# EAGLE schematic routev3.3 (EAGLE 8.6.0)

## Sheet 1 of 2
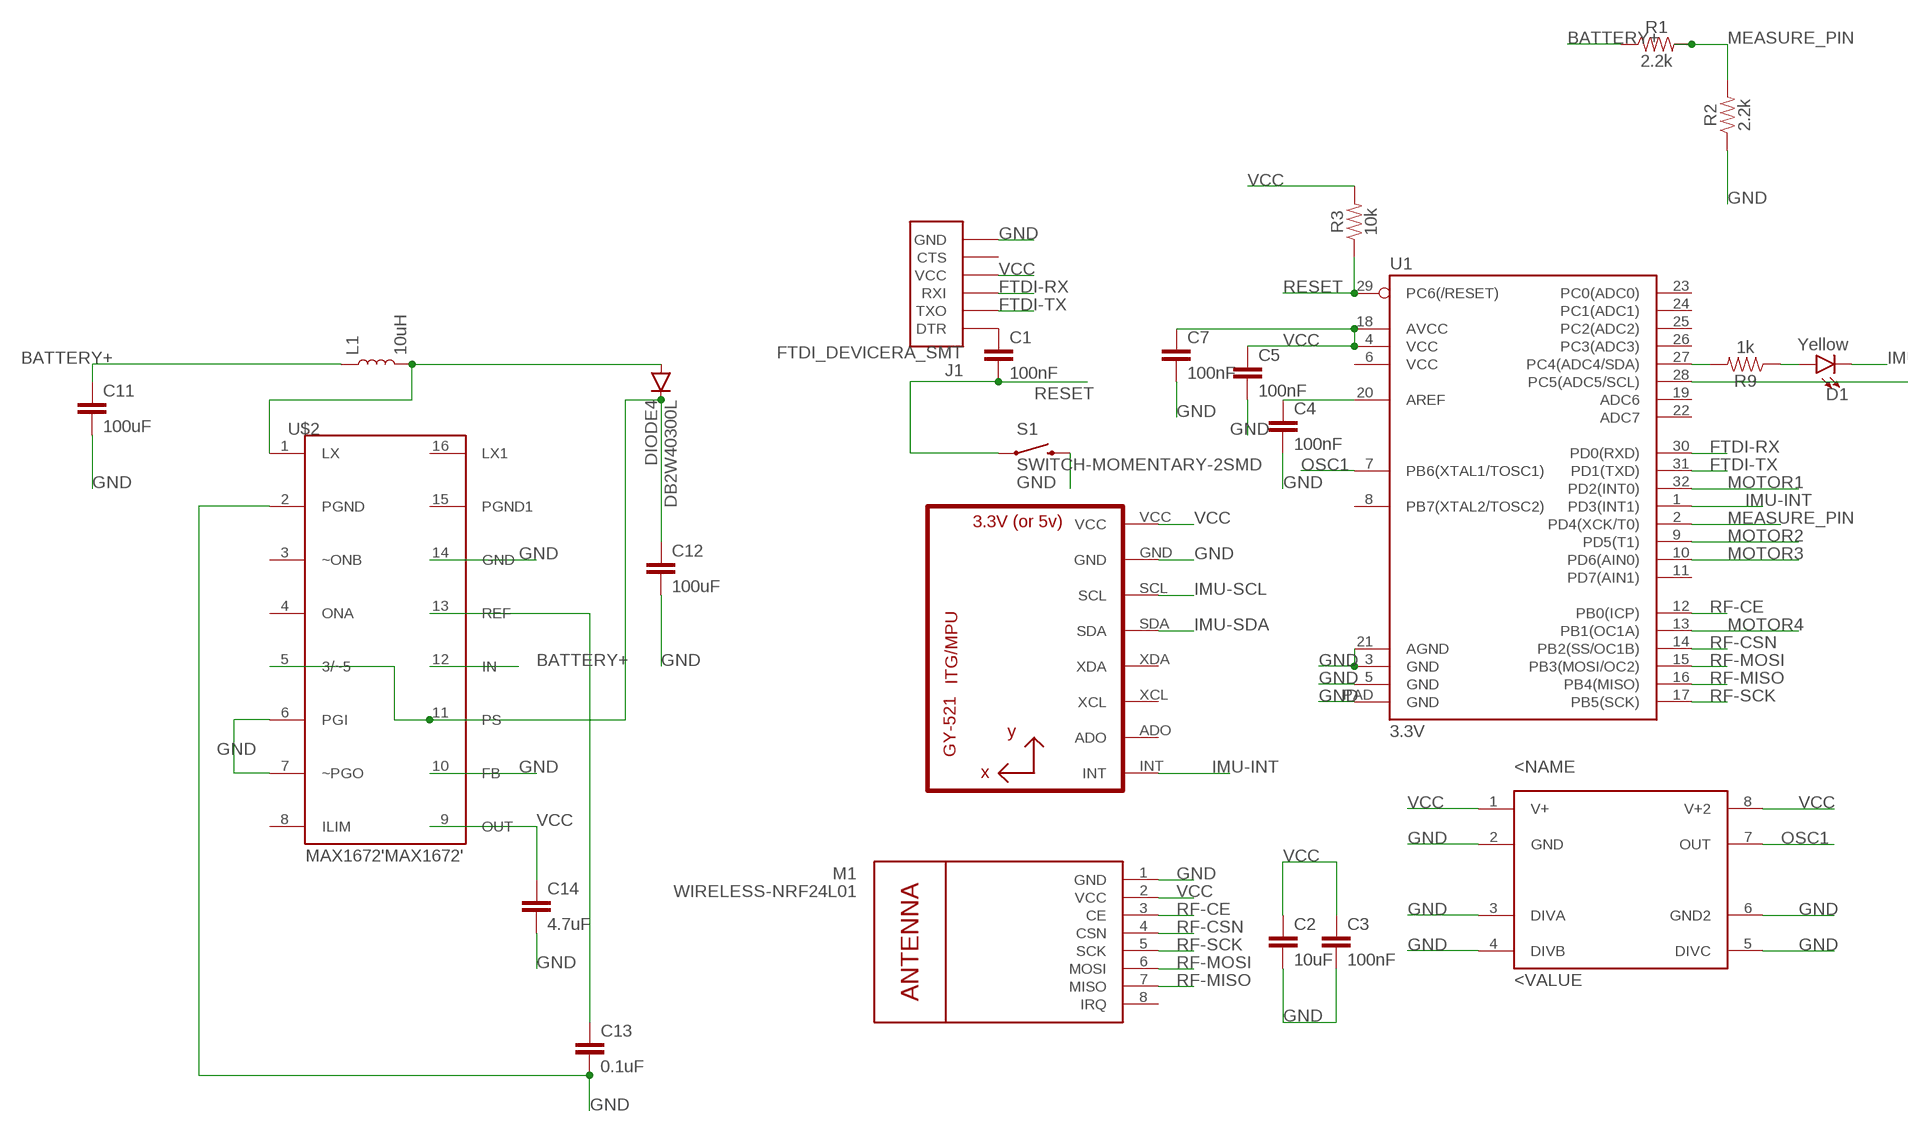
[diagram p0: schematic, sheet 1, part 1 of 2]
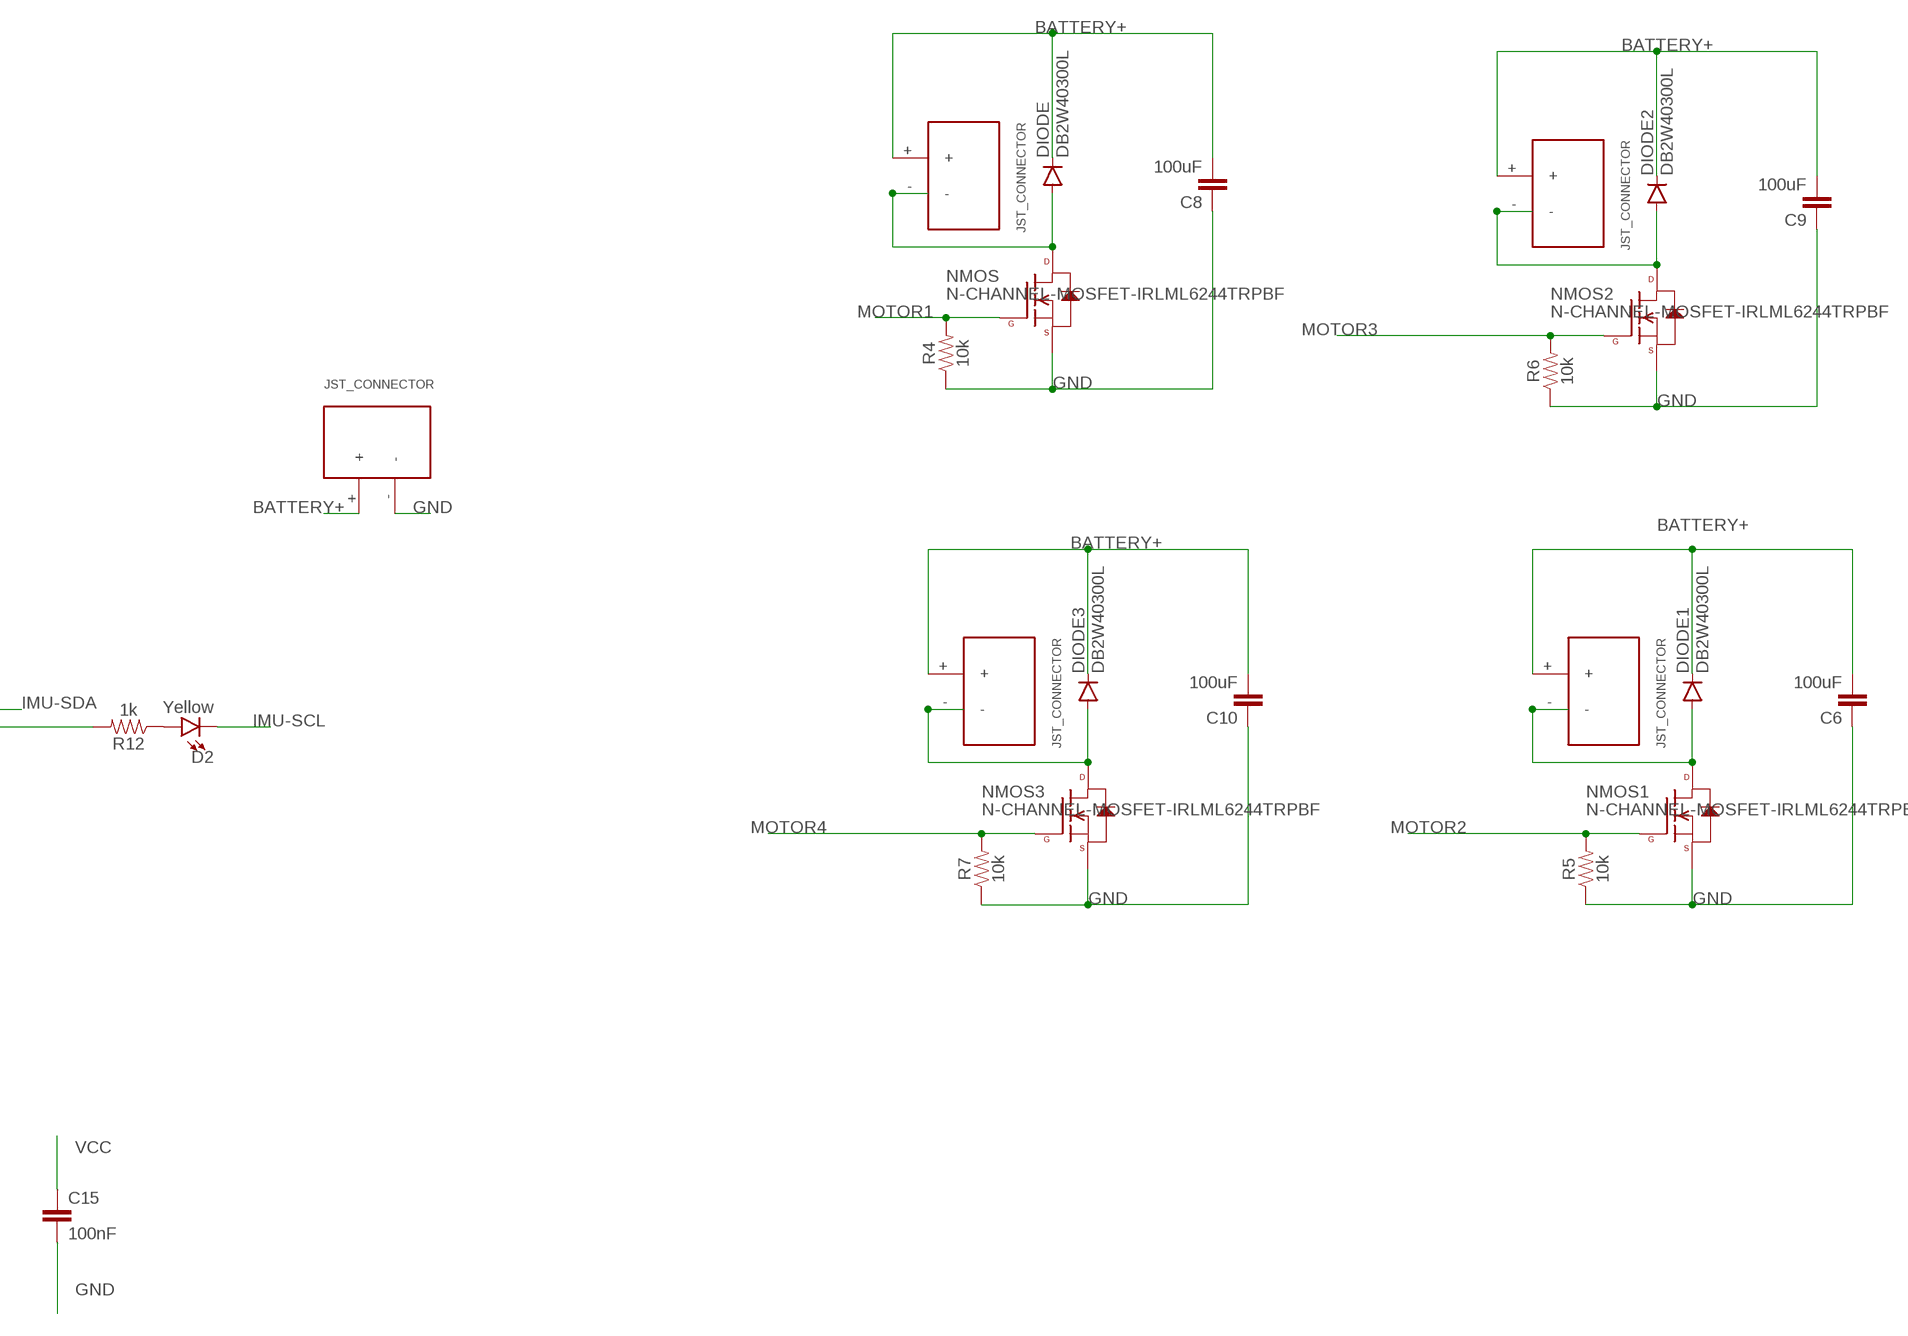
[diagram p1: schematic, sheet 1, part 2 of 2]

### Parts
C1  100nF  0.1UF-25V(+80/-20%)(0603)  [0603-CAP]
C2  10uF  CAP0603-CAP  [0603-CAP]
C3  100nF  CAP0603-CAP  [0603-CAP]
C4  100nF  CAP0603-CAP  [0603-CAP]
C5  100nF  CAP0603-CAP  [0603-CAP]
C6  100uF  CAP0603-CAP  [0603-CAP]
C7  100nF  CAP0603-CAP  [0603-CAP]
C8  100uF  CAP0603-CAP  [0603-CAP]
C9  100uF  CAP0603-CAP  [0603-CAP]
C10  100uF  CAP0603-CAP  [0603-CAP]
C11  100uF  CAP0603-CAP  [0603-CAP]
C12  100uF  CAP0603-CAP  [0603-CAP]
C13  0.1uF  CAP0603-CAP  [0603-CAP]
C14  4.7uF  CAP0603-CAP  [0603-CAP]
C15  100nF  0.1UF-25V(+80/-20%)(0603)  [0603-CAP]
D1  Yellow  LED-YELLOWLILYPAD  [LED-1206]
D2  Yellow  LED-YELLOWLILYPAD  [LED-1206]
DIODE  DB2W40300L  [MINI2-F3-B]
DIODE1  DB2W40300L  [MINI2-F3-B]
DIODE2  DB2W40300L  [MINI2-F3-B]
DIODE3  DB2W40300L  [MINI2-F3-B]
DIODE4  DB2W40300L  [MINI2-F3-B]
J1  FTDI_DEVICERA_SMT  [FTDI_DEVICE_RA_SMT]
L1  10uH  INDUCTOR-0603-33NH  [0603]
M1  WIRELESS-NRF24L01  [WIRELESS-NRF24L01]
MOTOR  JST_CONNECTOR_FEMALE  [JST_CONNECTOR_FEMALE]
MOTOR1  JST_CONNECTOR_FEMALE  [JST_CONNECTOR_FEMALE]
MOTOR2  JST_CONNECTOR_FEMALE  [JST_CONNECTOR_FEMALE]
MOTOR3  JST_CONNECTOR_FEMALE  [JST_CONNECTOR_FEMALE]
NMOS  N-CHANNEL-MOSFET-IRLML6244TRPBF  [SOT23-3]
NMOS1  N-CHANNEL-MOSFET-IRLML6244TRPBF  [SOT23-3]
NMOS2  N-CHANNEL-MOSFET-IRLML6244TRPBF  [SOT23-3]
NMOS3  N-CHANNEL-MOSFET-IRLML6244TRPBF  [SOT23-3]
R1  2.2k  2.2KOHM-0603-1/10W-1%  [0603]
R2  2.2k  2.2KOHM-0603-1/10W-1%  [0603]
R3  10k  2.2KOHM-0603-1/10W-1%  [0603]
R4  10k  2.2KOHM-0603-1/10W-1%  [0603]
R5  10k  2.2KOHM-0603-1/10W-1%  [0603]
R6  10k  2.2KOHM-0603-1/10W-1%  [0603]
R7  10k  2.2KOHM-0603-1/10W-1%  [0603]
R9  1k  2.2KOHM-0603-1/10W-1%  [0603]
R12  1k  2.2KOHM-0603-1/10W-1%  [0603]
S1  SWITCH-MOMENTARY-2SMD  [TACTILE-SWITCH-SMD]
U1  3.3V  ATMEGA328P_MLFMLF32  [MLF32-PAD]
U2  GY-521MPU6050  [GY-521]
U$1  JST_CONNECTOR_FEMALE  [JST_CONNECTOR_FEMALE]
U$2  MAX1672'MAX1672'  [21-0055H_16]
U$3  LTC6930CMS8-8.19LTC6930CMS8-8.19  [SOP65P490X110-8N]

### Nets
BATTERY+ [power]: C6.2 C8.2 C9.2 C10.2 C11.1 DIODE1.NEG(GPIN) DIODE2.NEG(GPIN) DIODE3.NEG(GPIN) DIODE.NEG(GPIN) L1.1 MOTOR1.+ MOTOR2.+ MOTOR3.+ MOTOR.+ R1.1 U$1.+ U$2.12(IN)
FTDI-RX: J1.3(RXI) U1.30(PD0(RXD))
FTDI-TX: J1.2(TXO) U1.31(PD1(TXD))
GND [power]: C2.2 C3.2 C4.2 C5.2 C6.1 C7.2 C8.1 C9.1 C10.1 C11.2 C12.2 C13.2 C14.2 C15.2 J1.6(GND) M1.1(GND) NMOS1.2(S) NMOS2.2(S) NMOS3.2(S) NMOS.2(S) R2.1 R4.1 R5.1 R6.1 R7.1 S1.3 U1.3(GND) U1.5(GND) U1.21(AGND) U1.PAD(GND) U2.GND U$1.- U$2.2(PGND) U$2.6(PGI) U$2.7(~PGO) U$2.10(FB) U$2.14(GND) U$3.2(GND) U$3.3(DIVA) U$3.4(DIVB) U$3.5(DIVC) U$3.6(GND2)
IMU-INT: U1.1(PD3(INT1)) U2.INT
IMU-SCL: D2.C U2.SCL
IMU-SDA: D1.C U2.SDA
MEASURE_PIN: R1.2 R2.2 U1.2(PD4(XCK/T0))
MOTOR1 [analog]: NMOS.1(G) R4.2 U1.32(PD2(INT0))
MOTOR2 [analog]: NMOS1.1(G) R5.2 U1.9(PD5(T1))
MOTOR3 [analog]: NMOS2.1(G) R6.2 U1.10(PD6(AIN0))
MOTOR4 [analog]: NMOS3.1(G) R7.2 U1.13(PB1(OC1A))
N$1: DIODE4.POS(PPIN) L1.2 U$2.1(LX)
N$2: C4.1 U1.20(AREF)
N$3: R9.2 U1.27(PC4(ADC4/SDA))
N$4: DIODE1.POS(PPIN) MOTOR1.- NMOS1.3(D)
N$5: DIODE2.POS(PPIN) MOTOR2.- NMOS2.3(D)
N$6: DIODE.POS(PPIN) MOTOR.- NMOS.3(D)
N$7: DIODE3.POS(PPIN) MOTOR3.- NMOS3.3(D)
N$8: D1.A R9.1
N$9: D2.A R12.1
N$10: R12.2 U1.28(PC5(ADC5/SCL))
N$13: C1.1 J1.1(DTR)
OSC1: U1.7(PB6(XTAL1/TOSC1)) U$3.7(OUT)
RESET: C1.2 R3.1 S1.1 U1.29(PC6(/RESET))
RF-CE: M1.3(CE) U1.12(PB0(ICP))
RF-CSN: M1.4(CSN) U1.14(PB2(SS/OC1B))
RF-MISO: M1.7(MISO) U1.16(PB4(MISO))
RF-MOSI: M1.6(MOSI) U1.15(PB3(MOSI/OC2))
RF-SCK: M1.5(SCK) U1.17(PB5(SCK))
VCC: C2.1 C3.1 C5.1 C7.1 C14.1 C15.1 J1.4(VCC) M1.2(VCC) R3.2 U1.4(VCC) U1.18(AVCC) U2.VCC U$2.9(OUT) U$3.1(V+) U$3.8(V+2)
VR-PS: C12.1 DIODE4.NEG(GPIN) U$2.5(3/~5) U$2.11(PS)
VR-REF: C13.1 U$2.13(REF)
Unconnected: J1.5(CTS) M1.8(IRQ) U1.6(VCC) U1.8(PB7(XTAL2/TOSC2)) U1.11(PD7(AIN1)) U1.19(ADC6) U1.22(ADC7) U1.23(PC0(ADC0)) U1.24(PC1(ADC1)) U1.25(PC2(ADC2)) U1.26(PC3(ADC3)) U2.ADO U2.XCL U2.XDA U$2.3(~ONB) U$2.4(ONA) U$2.8(ILIM) U$2.15(PGND1) U$2.16(LX1)

## Sheet 2 of 2

## Library data of the parts
C1 C15 = SparkFun-Capacitors:0.1UF-25V(+80/-20%)(0603): CAP-00810 Ceramic Standard decoupling cap; PROD_ID: CAP-00810; VALUE: 0.1uF
C2-C14 = SparkFun-Passives:CAP: Capacitor Standard 0603 ceramic capacitor, and 0.1" leaded capacitor.
D1 D2 = SparkFun-LED:LED-YELLOW: Yellow SMD LED Used in manufacturing several products at SparkFun. Packages: 0603 - SMD 0603 package[Product Link] <http://www.kingbrightusa.com/product.asp?catalog_name=LED&product_id=APT1608SYCK> 0603 -SMART - SMART SMD 0603 package (more efficient/more expensive) [Product Link] <http://www.osram-os.com/osram_os/en/products/product-catalog/led-light-emitting-diodes/smartled-0603/ly-l29k/index.jsp> LilyPad - SMD1206 package[Product Datasheet] <https://www.sparkfun.com/datasheets/DevTools/LilyPad/Q150YUS4.pdf> SparkFun Products: Blynk Board <https://www.sparkfun.com/products/13794> IOIO-OTG <https://www.sparkfun.com/products/13613> XBee Explorer Serial <https://www.sparkfun.com/products/13225>; PROD_ID: DIO-09909
DIODE DIODE1-DIODE4 = quad:DB2W40300L
J1 = quad:FTDI_DEVICE: Connector which mates to FTDI basic or FTDI cable.; PROD_ID: CONN-08971
L1 = SparkFun-Coils:INDUCTOR: Inductors Resist changes in electrical current. Basically a coil of wire. SparkFun Products: SparkFun Load Cell Amplifier - HX711 <https://www.sparkfun.com/products/13879> IOIO-OTG - V2.2 <https://www.sparkfun.com/products/13613>; PROD_ID: NDUC-07874; VALUE: 33nH/±5%/500mA
M1 = quad:WIRELESS-NRF24L01: 2.4 GHz Wireless Module based on NRF24L01 chip
MOTOR MOTOR1-MOTOR3 U$1 = quad:JST_CONNECTOR_FEMALE
NMOS NMOS1-NMOS3 = quad:N-CHANNEL-MOSFET: N-Channel MOSFET Mode Field Effect Transistor; DATASHEET: http://www.mouser.com/ds/2/196/irlml6244pbf-936666.pdf; MOUSER: 942-IRLML6244TRPBF; URL: http://www.mouser.com/Search/ProductDetail.aspx?R=IRLML6244TRPBFvirtualkey57370000virtualkey942-IRLML6244TRPBF
R1 R2 = SparkFun-Resistors:2.2KOHM: 2.2kΩ resistor A resistor is a passive two-terminal electrical component that implements electrical resistance as a circuit element. Resistors act to reduce current flow, and, at the same time, act to lower voltage levels within circuits. - Wikipedia; PROD_ID: RES-08272
R3-R7 R9 R12 = SparkFun-Resistors:2.2KOHM: 2.2kΩ resistor A resistor is a passive two-terminal electrical component that implements electrical resistance as a circuit element. Resistors act to reduce current flow, and, at the same time, act to lower voltage levels within circuits. - Wikipedia; PROD_ID: RES-08272; VALUE: 2.2k
S1 = quad:SWITCH-MOMENTARY-2: Various NO switches- pushbuttons, reed, etc; PROD_ID: SWCH-08247
U1 = SparkFun-DigitalIC:ATMEGA328P_MLF: 32-Pin Atmega328 part Commonly used on Arduino compatible boards Available in QFP and QFN packages TQFP is IC-09069 QFN is non-stock
U2 = quad:GY-521
U$2 = voltreg:MAX1672
U$3 = LTC6390:LTC6930CMS8-8.19

## Net classes
0 default: width 0.305 mm
1 analog: width 0.508 mm
2 power: width 0.762 mm